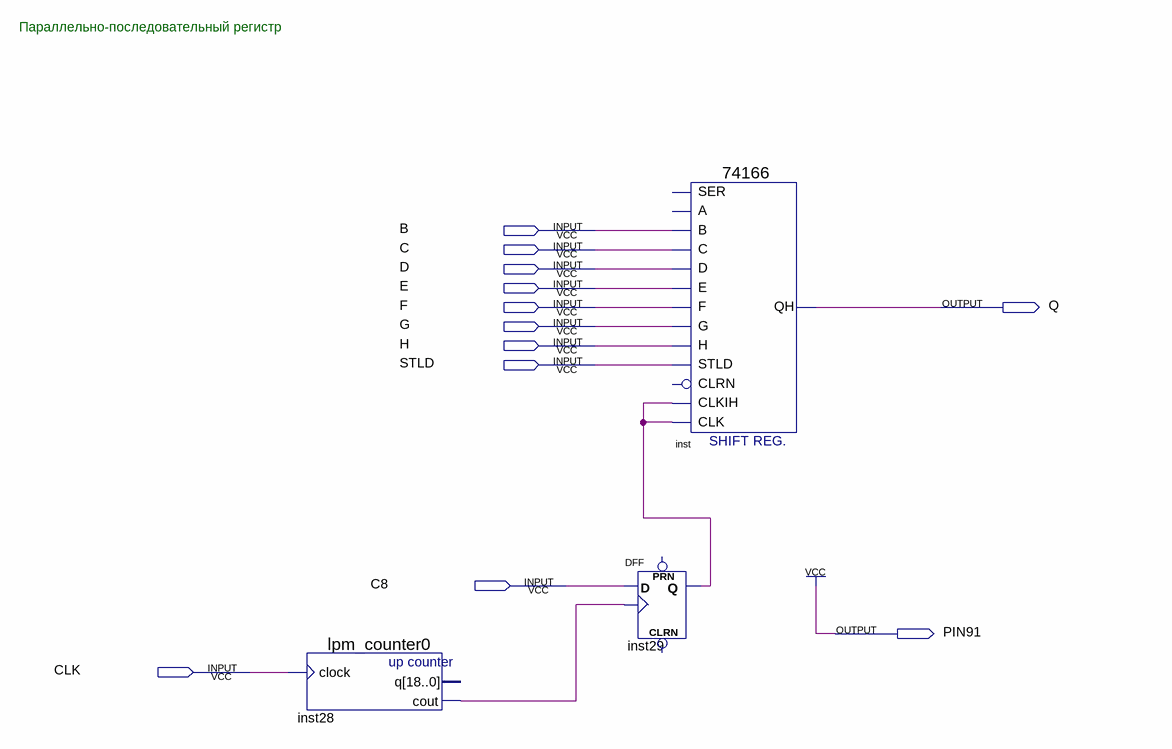
[diagram p0: schematic sheet]
// Quartus schematic Registers2.bdf as structural Verilog: 3 symbols, 12 pins
module Registers2 (
  input  B,
  input  C,
  input  D,
  input  E,
  input  F,
  input  G,
  input  H,
  input  STLD,
  input  C8,
  input  CLK,
  output Q,
  output PIN91
);

  wire inst28_cout, inst29_q;

  lpm_counter0 inst28 (.clock(CLK), .cout(inst28_cout));  // open: q
  DFF inst29 (.CLK(inst28_cout), .D(C8), .Q(inst29_q));  // open: CLRN, PRN
  \74166  inst (
    .C(C), .D(D), .E(E), .B(B), .STLD(STLD), .H(H), .G(G), .F(F), .CLK(inst29_q), .CLKIH(inst29_q), .QH(Q));  // open: SER, A, CLRN

  assign PIN91 = 1'b1;

  // Notes on the sheet:
  //   Параллельно-последовательный регистр
endmodule
